# Altium schematic sheet 2_MCU_MSP430.SchDoc
size A3
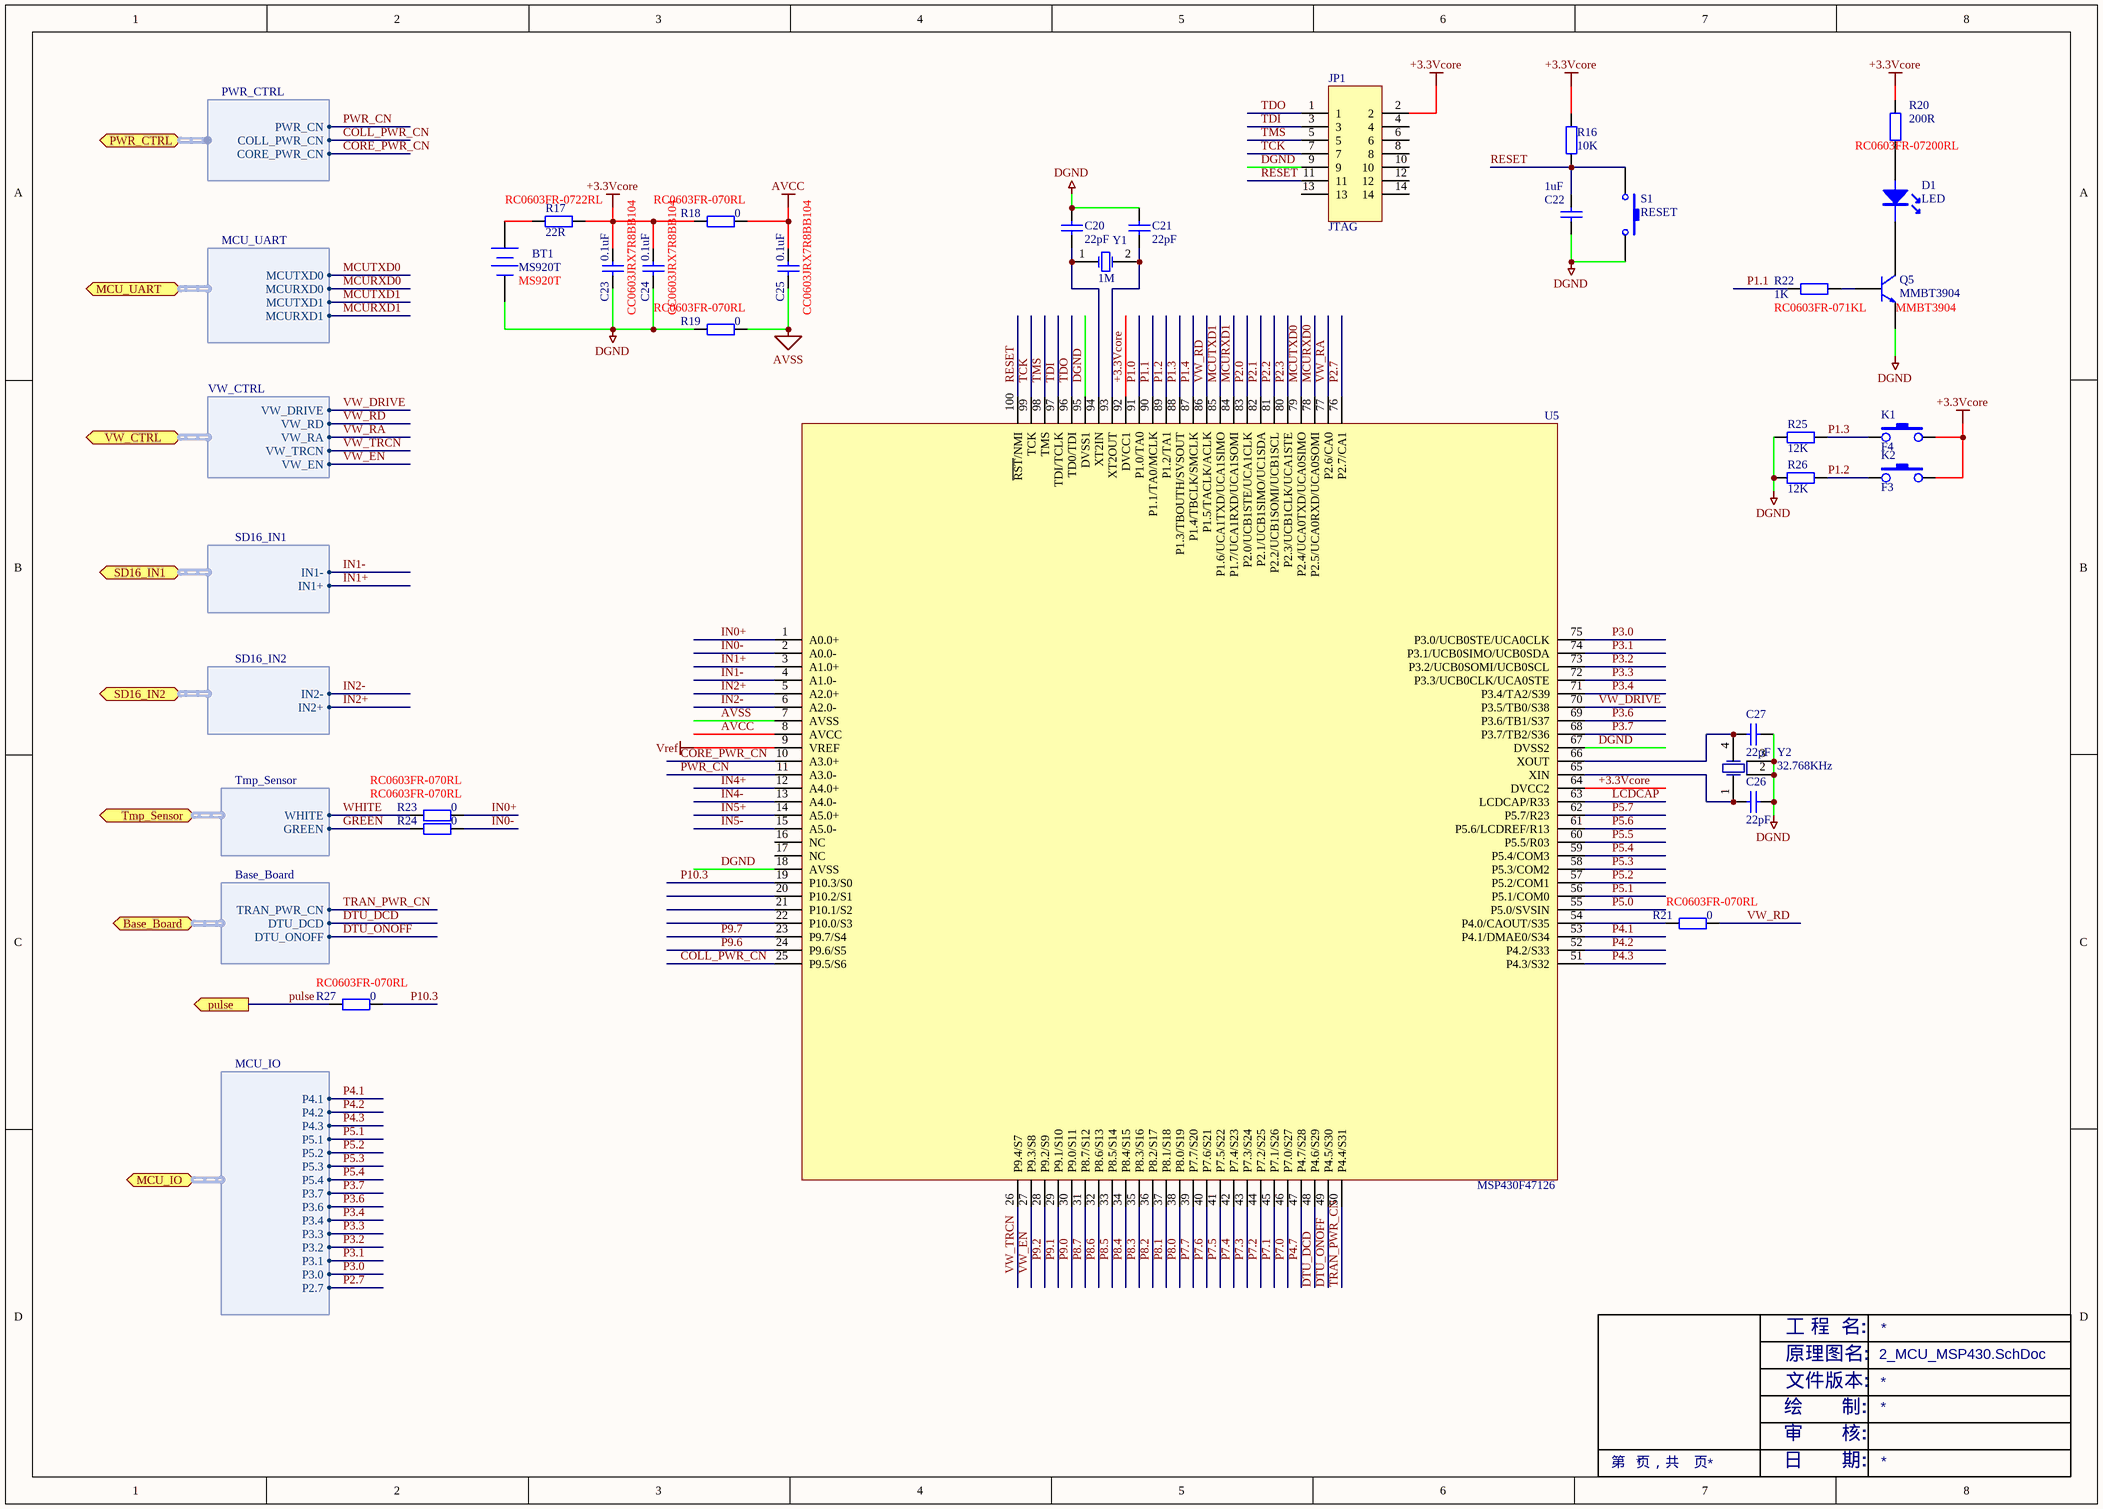
[diagram p0: 2_MCU_MSP430.SchDoc]

## Parts
BT1  MS920T  [MS920T]
C20  22pF  [CC0603]
C21  22pF  [CC0603]
C22  1uF  [CC0603]
C23  0.1uF  Type No.: CC0603JRX7R8BB104  [CC0603]
C24  0.1uF  Type No.: CC0603JRX7R8BB104  [CC0603]
C25  0.1uF  Type No.: CC0603JRX7R8BB104  [CC0603]
C26  22pF  [CC0603]
C27  22pF  [CC0603]
D1  LED  [D0805]
JP1  JTAG  [IDC14-2.0MM]
K1  F4  [SPST]
K2  F3  [SPST]
Q5  MMBT3904  [SOT-23W]
R16  10K  [CC0603]
R17  22R  Type No.: RC0603FR-0722RL  [CC0603]
R18  0  Type No.: RC0603FR-070RL  [CC0603]
R19  0  Type No.: RC0603FR-070RL  [CC0603]
R20  200R  Type No.: RC0603FR-07200RL  [CC0603]
R21  0  Type No.: RC0603FR-070RL  [CC0603]
R22  1K  Type No.: RC0603FR-071KL  [CC0603]
R23  0  Type No.: RC0603FR-070RL  [CC0603]
R24  0  Type No.: RC0603FR-070RL  [CC0603]
R25  12K  [CC0603]
R26  12K  [CC0603]
R27  0  Type No.: RC0603FR-070RL  [CC0603]
S1  RESET  [SPST]
U5  MSP430F47126  [TQFP100]
Y1  1M  [XCYAI]
Y2  32.768KHz  [MC-146]

## Ports
Base_Board (harness Base_Board), MCU_IO (harness MCU_IO), MCU_UART (harness MCU_UART), pulse, PWR_CTRL (harness PWR_CTRL), SD16_IN1 (harness SD16_IN1), SD16_IN2 (harness SD16_IN2), Tmp_Sensor (harness Tmp_Sensor), VW_CTRL (harness VW_CTRL)

## Harnesses
MCU_UART: MCUTXD1, MCURXD1, MCURXD0, MCUTXD0
PWR_CTRL: PWR_CN, COLL_PWR_CN, CORE_PWR_CN
SD16_IN1: IN1+, IN1-
SD16_IN2: IN2+, IN2-
Tmp_Sensor: GREEN, WHITE
VW_CTRL: VW_RA, VW_DRIVE, VW_TRCN, VW_EN, VW_RD
Base_Board: TRAN_PWR_CN, DTU_DCD, DTU_ONOFF
MCU_IO: P4.1, P4.2, P4.3, P5.1, P5.2, P5.3, P5.4, P3.0, P3.1, P3.2, P3.3, P3.4, P2.7, P3.6, P3.7

## Nets
+3.3Vcore: C23.2 C24.2 JP1.2 K1.2 K2.2 R16.2 R17.1 R18.2 R20.2 U5.64(DVCC2) U5.92(DVCC1)
AVCC: C25.2 R18.1 U5.8(AVCC)
AVSS: C25.1 R19.1 U5.7(AVSS)
DGND: BT1.2(-) C20.1 C21.1 C22.1 C23.1 C24.1 C26.2 C27.2 JP1.9 Q5.2 R19.2 R25.1 R26.1 S1.1 U5.18(AVSS) U5.67(DVSS2) U5.95(DVSS1) Y2.2(GND) Y2.3(GND)
Vref: U5.9(VREF)
COLL_PWR_CN: U5.25(P9.5/S6) ; port PWR_CTRL.COLL_PWR_CN
CORE_PWR_CN: U5.10(A3.0+) ; port PWR_CTRL.CORE_PWR_CN
DTU_DCD: U5.48(P4.6/S29) ; port Base_Board.DTU_DCD
DTU_ONOFF: U5.49(P4.5/S30) ; port Base_Board.DTU_ONOFF
GREEN: R24.2 ; port Tmp_Sensor.GREEN
IN0+: R23.1 U5.1(A0.0+)
IN0-: R24.1 U5.2(A0.0-)
IN1+: U5.3(A1.0+) ; port SD16_IN1.IN1+
IN1-: U5.4(A1.0-) ; port SD16_IN1.IN1-
IN2+: U5.5(A2.0+) ; port SD16_IN2.IN2+
IN2-: U5.6(A2.0-) ; port SD16_IN2.IN2-
IN4+: U5.12(A4.0+)
IN4-: U5.13(A4.0-)
IN5+: U5.14(A5.0+)
IN5-: U5.15(A5.0-)
LCDCAP: U5.63(LCDCAP/R33)
MCURXD0: U5.78(P2.5/UCA0RXD/UCA0SOMI) ; port MCU_UART.MCURXD0
MCURXD1: U5.84(P1.7/UCA1RXD/UCA1SOMI) ; port MCU_UART.MCURXD1
MCUTXD0: U5.79(P2.4/UCA0TXD/UCA0SIMO) ; port MCU_UART.MCUTXD0
MCUTXD1: U5.85(P1.6/UCA1TXD/UCA1SIMO) ; port MCU_UART.MCUTXD1
P1.0: U5.91(P1.0/TA0)
P1.1: R22.2 U5.90(P1.1/TA0/MCLK)
P1.2: K2.1 R26.2 U5.89(P1.2/TA1)
P1.3: K1.1 R25.2 U5.88(P1.3/TBOUTH/SVSOUT)
P1.4: U5.87(P1.4/TBCLK/SMCLK)
P2.0: U5.83(P2.0/UCB1STE/UCA1CLK)
P2.1: U5.82(P2.1/UCB1SIMO/UC1SDA)
P2.2: U5.81(P2.2/UCB1SOMI/UCB1SCL)
P2.3: U5.80(P2.3/UCB1CLK/UCA1STE)
P2.7: U5.76(P2.7/CA1) ; port MCU_IO.P2.7
P3.0: U5.75(P3.0/UCB0STE/UCA0CLK) ; port MCU_IO.P3.0
P3.1: U5.74(P3.1/UCB0SIMO/UCB0SDA) ; port MCU_IO.P3.1
P3.2: U5.73(P3.2/UCB0SOMI/UCB0SCL) ; port MCU_IO.P3.2
P3.3: U5.72(P3.3/UCB0CLK/UCA0STE) ; port MCU_IO.P3.3
P3.4: U5.71(P3.4/TA2/S39) ; port MCU_IO.P3.4
P3.6: U5.69(P3.6/TB1/S37) ; port MCU_IO.P3.6
P3.7: U5.68(P3.7/TB2/S36) ; port MCU_IO.P3.7
P4.1: U5.53(P4.1/DMAE0/S34) ; port MCU_IO.P4.1
P4.2: U5.52(P4.2/S33) ; port MCU_IO.P4.2
P4.3: U5.51(P4.3/S32) ; port MCU_IO.P4.3
P4.7: U5.47(P4.7/S28)
P5.0: U5.55(P5.0/SVSIN)
P5.1: U5.56(P5.1/COM0) ; port MCU_IO.P5.1
P5.2: U5.57(P5.2/COM1) ; port MCU_IO.P5.2
P5.3: U5.58(P5.3/COM2) ; port MCU_IO.P5.3
P5.4: U5.59(P5.4/COM3) ; port MCU_IO.P5.4
P5.5: U5.60(P5.5/R03)
P5.6: U5.61(P5.6/LCDREF/R13)
P5.7: U5.62(P5.7/R23)
P7.0: U5.46(P7.0/S27)
P7.1: U5.45(P7.1/S26)
P7.2: U5.44(P7.2/S25)
P7.3: U5.43(P7.3/S24)
P7.4: U5.42(P7.4/S23)
P7.5: U5.41(P7.5/S22)
P7.6: U5.40(P7.6/S21)
P7.7: U5.39(P7.7/S20)
P8.0: U5.38(P8.0/S19)
P8.1: U5.37(P8.1/S18)
P8.2: U5.36(P8.2/S17)
P8.3: U5.35(P8.3/S16)
P8.4: U5.34(P8.4/S15)
P8.5: U5.33(P8.5/S14)
P8.6: U5.32(P8.6/S13)
P8.7: U5.31(P8.7/S12)
P9.0: U5.30(P9.0/S11)
P9.1: U5.29(P9.1/S10)
P9.2: U5.28(P9.2/S9)
P9.6: U5.24(P9.6/S5)
P9.7: U5.23(P9.7/S4)
P10.3: R27.1 U5.19(P10.3/S0)
pulse: R27.2 ; port pulse
PWR_CN: U5.11(A3.0-) ; port PWR_CTRL.PWR_CN
RESET: C22.2 JP1.11 R16.1 S1.2 U5.100(~{RST}/NMI)
TCK: JP1.7 U5.99(TCK)
TDI: JP1.3 U5.97(TDI/TCLK)
TDO: JP1.1 U5.96(TD0/TDI)
TMS: JP1.5 U5.98(TMS)
TRAN_PWR_CN: U5.50(P4.4/S31) ; port Base_Board.TRAN_PWR_CN
VW_DRIVE: U5.70(P3.5/TB0/S38) ; port VW_CTRL.VW_DRIVE
VW_EN: U5.27(P9.3/S8) ; port VW_CTRL.VW_EN
VW_RA: U5.77(P2.6/CA0) ; port VW_CTRL.VW_RA
VW_RD: R21.1 U5.86(P1.5/TACLK/ACLK) ; port VW_CTRL.VW_RD
VW_TRCN: U5.26(P9.4/S7) ; port VW_CTRL.VW_TRCN
WHITE: R23.2 ; port Tmp_Sensor.WHITE
NetBT1_1: BT1.1(+) R17.2
NetC20_2: C20.2 U5.94(XT2IN) Y1.1(OSC1)
NetC21_2: C21.2 U5.93(XT2OUT) Y1.2(OSC2)
NetC26_1: C26.1 U5.65(XIN) Y2.1(X1)
NetC27_1: C27.1 U5.66(XOUT) Y2.4(X2)
NetD1_1: D1.1(A) R20.1
NetD1_2: D1.2(K) Q5.3
NetQ5_1: Q5.1 R22.1
NetR21_2: R21.2 U5.54(P4.0/CAOUT/S35)

Not connected (* = marked no-connect by the designer): JP1 4 6 8 10 12 13 14; U5 16(NC) 17(NC) 20(P10.2/S1) 21(P10.1/S2) 22(P10.0/S3)

## Notes on the sheet
- 文件版本:
- 原理图名:
- 工 程  名:
- 绘       制:
- 审       核:
- 第   页，共    页
- 日       期:

## Library data of the parts
BT1 = Battery: Multicell Battery; Type No.: MS920T
C20-C22 C26 C27 = Cap: Capacitor; Value: 100pF; Published: 8-Jun-2000; LatestRevisionDate: 17-Jul-2002; LatestRevisionNote: Re-released for DXP Platform.; PackageReference: RAD-0.3; Publisher: Altium Limited
C23-C25 = Cap: Capacitor
JP1 = Header2*7
K1 K2 = KEY_1
Q5 = NPN: Type No.: MMBT3904
R16 R25 R26 = Res2: Resistor; Value: 1K; Published: 8-Jun-2000; LatestRevisionDate: 17-Jul-2002; LatestRevisionNote: Re-released for DXP Platform.; PackageReference: AXIAL-0.4; Publisher: Altium Limited
R17-R24 R27 = Res2: Resistor
S1 = SW-PB: Switch; Published: 24-Mar-1999; LatestRevisionDate: 17-Jul-2002; LatestRevisionNote: Re-released for DXP Platform.; PackageReference: SPST-2; Publisher: Altium Limited
Y1 = XTAL: Crystal Oscillator; Published: 8-Jun-2000; LatestRevisionDate: 17-Jul-2002; LatestRevisionNote: Re-released for DXP Platform.; PackageReference: R38; Publisher: Altium Limited
Y2 = MC-146